# EAGLE schematic lockcontroller_V2 (EAGLE 6.3)
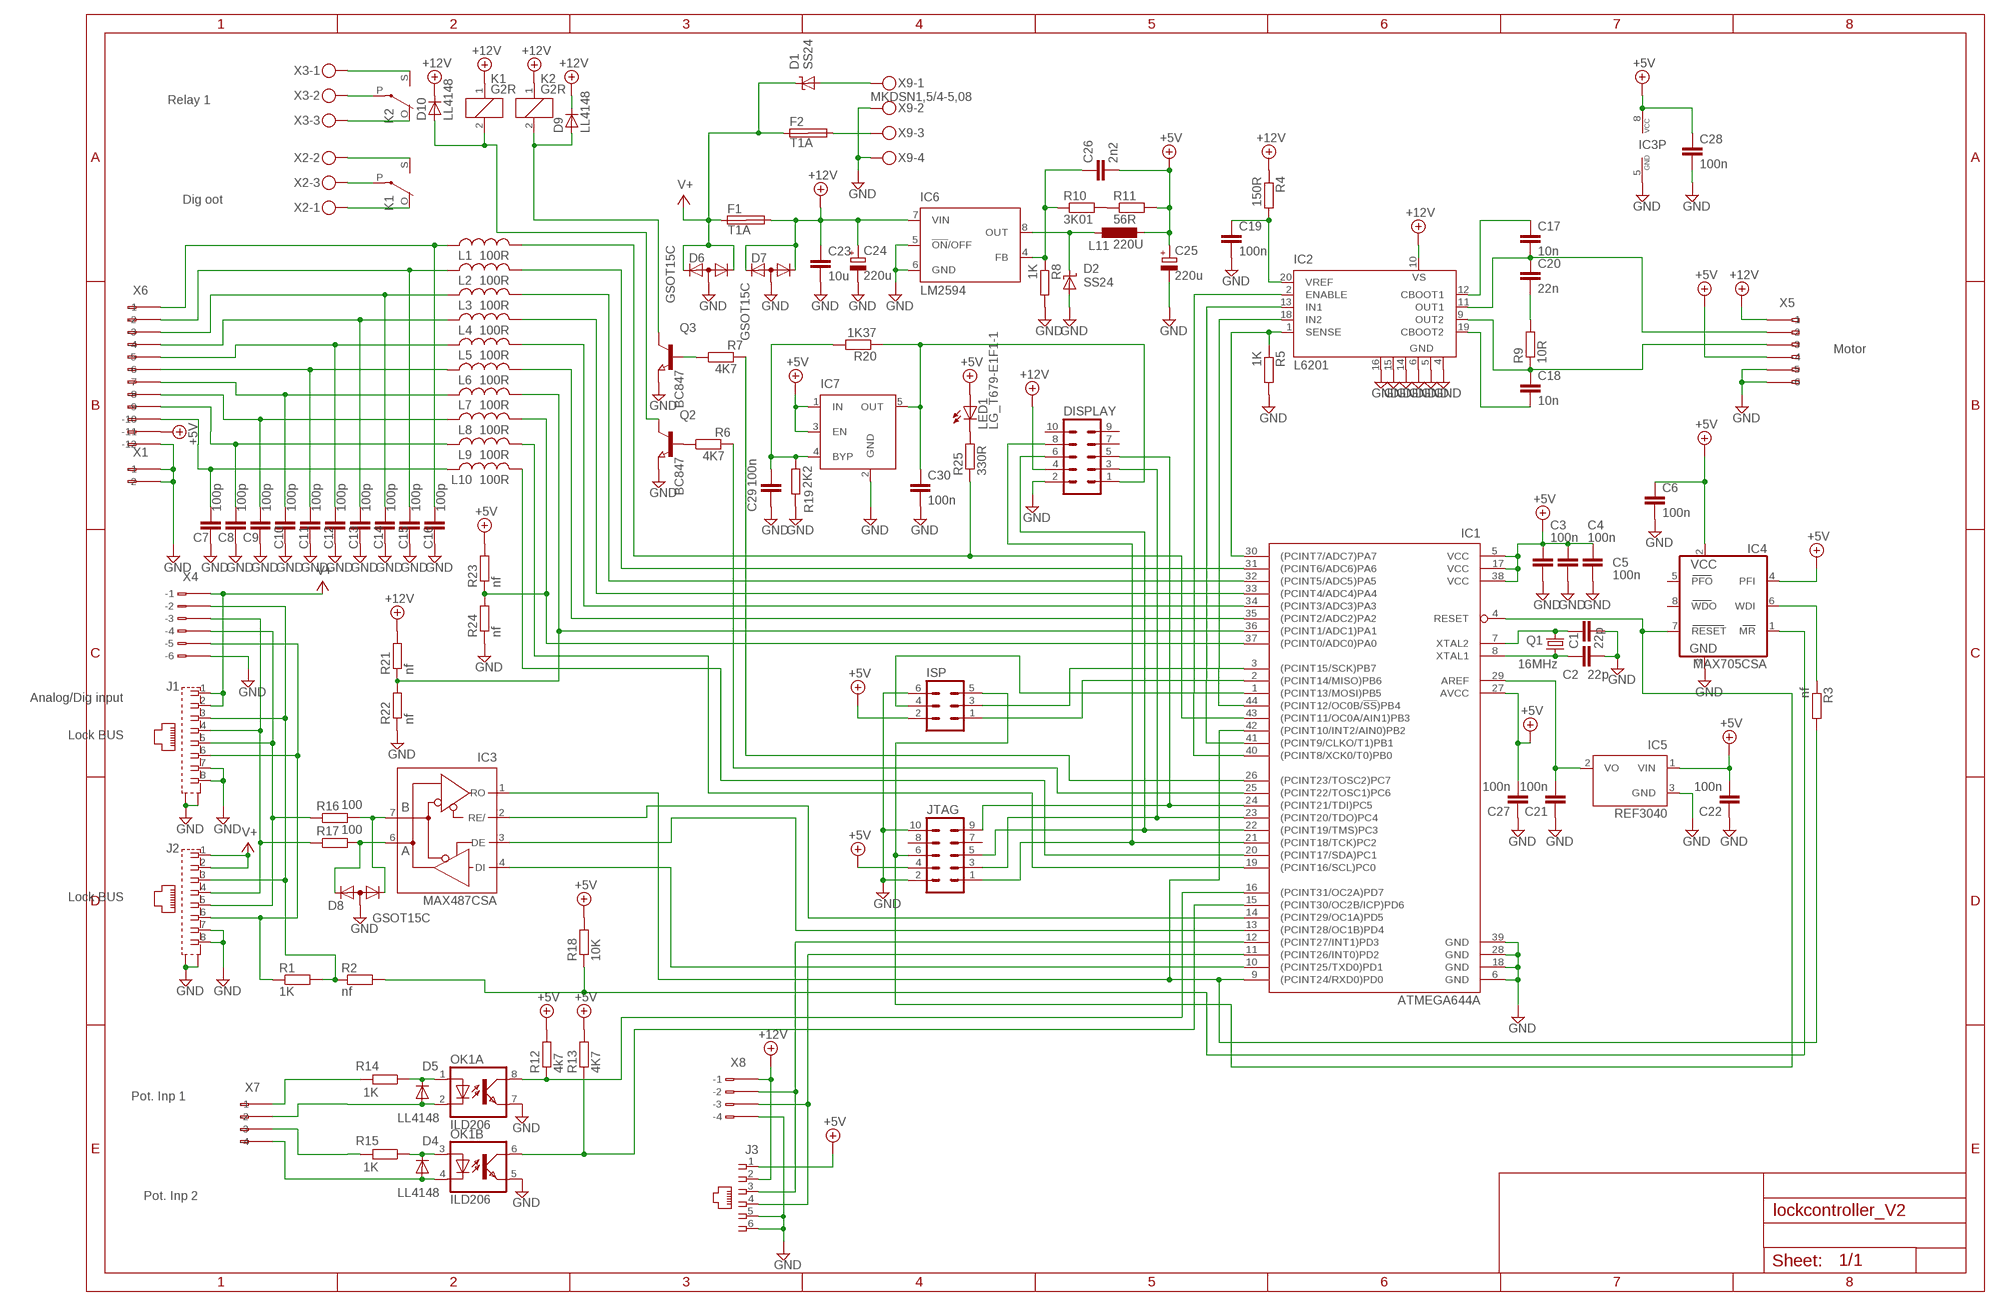
[diagram p0: schematic, sheet 1]

## Parts
C1  22p  C-EUC0603  [C0603]
C2  22p  C-EUC0603  [C0603]
C3  100n  C-EUC0603  [C0603]
C4  100n  C-EUC0603  [C0603]
C5  100n  C-EUC0603  [C0603]
C6  100n  C-EUC0603  [C0603]
C7  100p  C-EUC0603  [C0603]
C8  100p  C-EUC0603  [C0603]
C9  100p  C-EUC0603  [C0603]
C10  100p  C-EUC0603  [C0603]
C11  100p  C-EUC0603  [C0603]
C12  100p  C-EUC0603  [C0603]
C13  100p  C-EUC0603  [C0603]
C14  100p  C-EUC0603  [C0603]
C15  100p  C-EUC0603  [C0603]
C16  100p  C-EUC0603  [C0603]
C17  10n  C-EUC1206  [C1206]
C18  10n  C-EUC1206  [C1206]
C19  100n  C-EUC0603  [C0603]
C20  22n  C-EUC1206  [C1206]
C21  100n  C-EUC0603  [C0603]
C22  100n  C-EUC0603  [C0603]
C23  10u  C-EUC1210  [C1210]
C24  220u  CPOL-EUE5-8.5  [E5-8,5]
C25  220u  CPOL-EUE5-8.5  [E5-8,5]
C26  2n2  C-EUC0603  [C0603]
C27  100n  C-EUC0603  [C0603]
C28  100n  C-EUC0603  [C0603]
C29  100n  C-EUC0603  [C0603]
C30  100n  C-EUC0603  [C0603]
D1  SS24  SUPPRESSOR-SMBG  [SMBG]
D2  SS24  SUPPRESSOR-SMBG  [SMBG]
D4  LL4148  D-MLL-34  [MELF-MLL34]
D5  LL4148  D-MLL-34  [MELF-MLL34]
D6  GSOT15C  DIODE_CA-AC__  [SOT23C]
D7  GSOT15C  DIODE_CA-AC__  [SOT23C]
D8  GSOT15C  DIODE_CA-AC__  [SOT23C]
D9  LL4148  D-MLL-34  [MELF-MLL34]
D10  LL4148  D-MLL-34  [MELF-MLL34]
DISPLAY  MA05-2  [MA05-2]
F1  T1A  SHK20L  [SHK20L]
F2  T1A  SHK20L  [SHK20L]
IC1  ATMEGA644A  [TQFP44]
IC2  L6201  [SO20]
IC3  MAX487CSA  MAX481CSA  [SO08]
IC4  MAX705CSA  [SO08]
IC5  REF3040  MC1525TT  [SOT23]
IC6  LM2594  [SO08]
IC7  MIC5219XX  [SOT23-5]
ISP  MA03-2  [MA03-2]
J1  555141-1  [555153-1]
J2  555141-1  [555153-1]
J3  520250-3  [520250-3]
JTAG  MA05-2  [MA05-2]
K1  G2R  [G2R]
K2  G2R  [G2R]
L1  100R  L-US0603  [R0603]
L2  100R  L-US0603  [R0603]
L3  100R  L-US0603  [R0603]
L4  100R  L-US0603  [R0603]
L5  100R  L-US0603  [R0603]
L6  100R  L-US0603  [R0603]
L7  100R  L-US0603  [R0603]
L8  100R  L-US0603  [R0603]
L9  100R  L-US0603  [R0603]
L10  100R  L-US0603  [R0603]
L11  220U  DO3316P  [DO3316P]
LED1  LG_T679-E1F1-1  [PLCC2]
OK1  ILD206  [SOIC08]
Q1  16MHz  CRYSTALHC49S  [HC49/S]
Q2  BC847  NPN-TRANSISTOR_SOT23  [SOT23]
Q3  BC847  NPN-TRANSISTOR_SOT23  [SOT23]
R1  1K  R-EU_R0603  [R0603]
R2  nf  R-EU_R0603  [R0603]
R3  nf  R-EU_R0603  [R0603]
R4  150R  R-EU_R0603  [R0603]
R5  1K  R-EU_R0603  [R0603]
R6  4K7  R-EU_R0603  [R0603]
R7  4K7  R-EU_R0603  [R0603]
R8  1K  R-EU_R0603  [R0603]
R9  10R  R-EU_R1206  [R1206]
R10  3K01  R-EU_R0603  [R0603]
R11  56R  R-EU_R0603  [R0603]
R12  4k7  R-EU_R0603  [R0603]
R13  4K7  R-EU_R0603  [R0603]
R14  1K  R-EU_R0603  [R0603]
R15  1K  R-EU_R0603  [R0603]
R16  100  R-EU_R0603  [R0603]
R17  100  R-EU_R0603  [R0603]
R18  10K  R-EU_R0603  [R0603]
R19  2K2  R-EU_R0603  [R0603]
R20  1K37  R-EU_R0603  [R0603]
R21  nf  R-EU_R0603  [R0603]
R22  nf  R-EU_R0603  [R0603]
R23  nf  R-EU_R0603  [R0603]
R24  nf  R-EU_R0603  [R0603]
R25  330R  R-EU_R0603  [R0603]
X1  233-502  [233-502]
X2  MKDSN1,5/3-5,08  [MKDSN1,5/3-5,08]
X3  MKDSN1,5/3-5,08  [MKDSN1,5/3-5,08]
X4  233-506  [233-506]
X5  233-506  [233-506]
X6  233-512  [233-512]
X7  233-504  [233-504]
X8  233-504  [233-504]
X9  MKDSN1,5/4-5,08  [MKDSN1,5/4-5,08]

## Nets
+5V: C3.1 C4.1 C5.1 C6.1 C22.2 C25.+ C26.2 C27.2 C28.1 IC1.5(VCC) IC1.17(VCC) IC1.27(AVCC) IC1.38(VCC) IC3.8(VCC) IC4.2(VCC) IC4.4(PFI) IC5.1(VIN) IC7.1(IN) IC7.3(EN) ISP.2 J3.1 JTAG.4 L11.2 LED1.A R11.2 R12.2 R13.2 R18.2 R23.2 X5.A4(-4) X6.A11(-11)
+12V: C23.1 C24.+ D7.1(K1) D7.2(K2) D9.1(C) D10.1(C) DISPLAY.4 F1.2A IC2.10(VS) IC6.7(VIN) J3.2 K1.1 K2.1 R4.1 R21.2 X5.A1(-1) X8.B1(B-1)
GND: C1.2 C2.2 C3.2 C4.2 C5.2 C6.2 C7.2 C8.2 C9.2 C10.2 C11.2 C12.2 C13.2 C14.2 C15.2 C16.2 C19.2 C21.1 C22.1 C23.2 C24.- C25.- C27.1 C28.2 C29.2 C30.2 D2.A D6.3(A) D7.3(A) D8.3(A) DISPLAY.2 IC1.6(GND) IC1.18(GND) IC1.28(GND) IC1.39(GND) IC2.4(GND) IC2.5(GND) IC2.6(GND) IC2.14(GND) IC2.15(GND) IC2.16(GND) IC3.5(GND) IC4.3(GND) IC5.3(GND) IC6.5(!ON!/OFF) IC6.6(GND) IC7.2(GND) ISP.6 J1.7 J1.8 J1.G1(S1) J1.G2(S2) J2.7 J2.8 J2.G1(S1) J2.G2(S2) J3.5 J3.6 JTAG.2 JTAG.10 OK1.5(B:EMIT) OK1.7(A:EMIT) Q2.2(E) Q3.2(E) R5.2 R8.2 R19.1 R22.1 R24.1 X1.A1(-1) X1.A2(-2) X4.B6(B-6) X5.A5(-5) X5.A6(-6) X6.A12(-12) X8.B4(B-4) X9.2 X9.4
N$1: K2.P(2:P) X3.2
N$2: IC1.10((PCINT25/TXD0)PD1) IC3.4(DI)
N$3: IC1.13((PCINT28/OC1B)PD4) IC3.3(DE)
N$4: IC1.14((PCINT29/OC1A)PD5) IC3.2(RE/)
N$5: J1.4 J2.4 R17.1 X4.B3(B-3)
N$6: J1.5 J2.5 R16.1 X4.B4(B-4)
N$7: C2.1 IC1.8(XTAL1) Q1.1
N$8: C1.1 IC1.7(XTAL2) Q1.2
N$9: IC1.4(RESET) IC4.7(RESET) ISP.5 JTAG.6
N$10: C11.1 L6.1 X6.A6(-6)
N$11: C16.1 L1.1 X6.A1(-1)
N$12: IC1.16((PCINT31/OC2A)PD7) OK1.8(A:COL) R12.1
N$13: J1.6 J2.6 R1.1 X4.B5(B-5)
N$14: C15.1 L2.1 X6.A2(-2)
N$15: C14.1 L3.1 X6.A3(-3)
N$16: C13.1 L4.1 X6.A4(-4)
N$17: C12.1 L5.1 X6.A5(-5)
N$18: C10.1 L7.1 X6.A7(-7)
N$19: C9.1 L8.1 X6.A8(-8)
N$20: LED1.C R25.2
N$22: IC1.35((PCINT2/ADC2)PA2) L6.2
N$23: IC1.34((PCINT3/ADC3)PA3) L5.2
N$24: IC1.33((PCINT4/ADC4)PA4) L4.2
N$25: IC1.32((PCINT5/ADC5)PA5) L3.2
N$26: IC1.31((PCINT6/ADC6)PA6) L2.2
N$27: IC1.43((PCINT11/OC0A/AIN1)PB3) L1.2 R25.1
N$28: J1.3 J2.3 R1.2 R2.1 X4.B2(B-2)
N$29: C8.1 L9.1 X6.A9(-9)
N$30: C7.1 L10.1 X6.A10(-10)
N$31: IC1.19((PCINT16/SCL)PC0) L9.2
N$32: IC1.20((PCINT17/SDA)PC1) L10.2
N$33: IC1.44((PCINT12/OC0B/!SS!)PB4) IC2.18(IN2)
N$34: IC1.41((PCINT9/CLKO/T1)PB1) IC2.13(IN1)
N$35: K2.O(2:O) X3.3
N$36: K1.P(2:P) X2.3
N$37: K2.S(2:S) X3.1
N$38: K1.O(2:O) X2.1
N$39: K1.S(2:S) X2.2
N$40: D8.1(K1) IC3.7(B) R16.2
N$41: IC1.40((PCINT8/XCK0/T0)PB0) IC2.2(ENABLE)
N$42: C19.1 IC2.20(VREF) R4.2
N$43: IC1.30((PCINT7/ADC7)PA7) IC2.1(SENSE) R5.1
N$44: C18.1 IC2.9(OUT2) R9.1 X5.A3(-3)
N$45: C18.2 IC2.19(CBOOT2)
N$46: C17.1 IC2.12(CBOOT1)
N$47: C17.2 C20.1 IC2.11(OUT1) X5.A2(-2)
N$48: C20.2 R9.2
N$49: Q2.1(B) R6.1
N$50: Q3.1(B) R7.1
N$51: IC1.25((PCINT22/TOSC1)PC6) R6.2
N$52: IC1.26((PCINT23/TOSC2)PC7) R7.2
N$53: D9.2(A) K2.2 Q3.3(C)
N$54: C21.2 IC1.29(AREF) IC5.2(VO)
N$55: D10.2(A) K1.2 Q2.3(C)
N$56: IC1.11((PCINT26/INT0)PD2) J3.4 X8.B3(B-3)
N$57: IC4.6(WDI) R3.1
N$58: D2.C IC6.8(OUT) L11.1
N$59: IC1.12((PCINT27/INT1)PD3) J3.3 X8.B2(B-2)
N$60: R10.2 R11.1
N$61: C26.1 IC6.4(FB) R8.1 R10.1
N$62: C29.1 IC7.4(BYP) R19.2 R20.2
N$63: IC1.37((PCINT0/ADC0)PA0) L8.2 R23.1 R24.2
N$64: DISPLAY.3 IC1.23((PCINT20/TDO)PC4) JTAG.3
N$65: DISPLAY.6 IC1.22((PCINT19/TMS)PC3) JTAG.5
N$66: IC4.1(MR) R2.2 R18.1
N$67: IC1.15((PCINT30/OC2B/ICP)PD6) OK1.6(B:COL) R13.1
N$68: R14.2 X7.A1(-1)
N$69: D5.2(A) OK1.2(A:C) X7.A2(-2)
N$70: D5.1(C) OK1.1(A:A) R14.1
N$71: D4.1(C) OK1.3(B:A) R15.1
N$72: D4.2(A) OK1.4(B:C) X7.A4(-4)
N$73: R15.2 X7.A3(-3)
N$74: IC1.3((PCINT15/SCK)PB7) ISP.3
N$75: IC1.2((PCINT14/MISO)PB6) ISP.1
N$76: F2.2A X9.3
N$77: IC1.1((PCINT13/MOSI)PB5) ISP.4
N$78: IC1.9((PCINT24/RXD0)PD0) IC1.42((PCINT10/INT2/AIN0)PB2) IC3.1(RO) R3.2
N$79: D1.A X9.1
N$80: D8.2(K2) IC3.6(A) R17.2
N$81: DISPLAY.8 IC1.21((PCINT18/TCK)PC2) JTAG.1
N$82: C30.1 DISPLAY.1 IC7.5(OUT) R20.1
N$83: DISPLAY.5 IC1.24((PCINT21/TDI)PC5) JTAG.9
N$84: IC1.36((PCINT1/ADC1)PA1) L7.2 R21.1 R22.2
V+: D1.C D6.1(K1) D6.2(K2) F1.1A F2.1A J1.1 J1.2 J2.1 J2.2 X4.B1(B-1)
Unconnected: DISPLAY.7 DISPLAY.9 DISPLAY.10 F1.1B F1.2B F2.1B F2.2B IC4.5(PFO) IC4.8(WDO) JTAG.7 JTAG.8 X1.B1(B-1) X1.B2(B-2) X4.A1(-1) X4.A2(-2) X4.A3(-3) X4.A4(-4) X4.A5(-5) X4.A6(-6) X5.B1(B-1) X5.B2(B-2) X5.B3(B-3) X5.B4(B-4) X5.B5(B-5) X5.B6(B-6) X6.B1(B-1) X6.B2(B-2) X6.B3(B-3) X6.B4(B-4) X6.B5(B-5) X6.B6(B-6) X6.B7(B-7) X6.B8(B-8) X6.B9(B-9) X6.B10(B-10) X6.B11(B-11) X6.B12(B-12) X7.B1(B-1) X7.B2(B-2) X7.B3(B-3) X7.B4(B-4) X8.A1(-1) X8.A2(-2) X8.A3(-3) X8.A4(-4)

## Notes on the sheet
- Relay 1
- Dig oot
- Motor
- Analog/Dig input
- Lock BUS
- Lock BUS
- Pot. Inp 1
- Pot. Inp 2

## Library data of the parts
C1-C23 C26-C30 = rcl:C-EU: CAPACITOR, European symbol
C24 C25 = rcl:CPOL-EU: POLARIZED CAPACITOR, European symbol
D1 D2 = diode:SUPPRESSOR-: Suppressor diode
D4 D5 D9 D10 = semicon-smd-ipc:D-: DIODE unfilled
D6-D8 = semicon-smd-ipc:DIODE_CA-AC_: DUAL DIODE
DISPLAY JTAG = con-lstb:MA05-2: PIN HEADER
F1 F2 = fuse:SHK20L: FUSE HOLDER 5 x 20 mm, SH contact, SHH1 Schukat, E1073 Buerklin
IC1 = atmel:ATMEGA644: 8-bit Microcontroller with 64K Bytes In-System Programmable Flash Source: http://www.atmel.com/dyn/resources/prod_documents/doc2593.pdf
IC2 = st-microelectronics:L620: DMOS FULL BRIDGE DRIVER
IC3 = maxim:MAX481CSA: RS485 TRANSEIVER
IC4 = maxim:MAX705CSA: WATCHDOG
IC5 = microchip:MC15*: 2.5V and 4.096V Voltage References Source: http://www.microchip.com .. 21653b.pdf
IC6 = national-semiconductor:LM2594: LM2594 0.5 A Buck Converter
IC7 = v-reg-micrel:MIC5219XX: VOLTAGE REGULATOR; OC_FARNELL: unknown; OC_NEWARK: unknown
ISP = con-lstb:MA03-2: PIN HEADER
J1 J2 = con-amp:555141-1: AMP connector
J3 = con-amp:520250-3: AMP connector
K1 K2 = relay:G2R: RELAY 1 x switch, Omron
L1-L10 = rcl:L-US: INDUCTOR, American symbol
L11 = inductor-coilcraft:DO3316P: COILCRAFT
LED1 = led:*_T679-?-1: LC TOPLED® Low Current LED Source: http://catalog.osram-os.com .. LG_LS_LY_T679_OBS.pdf; COLOR: green
OK1 = optocoupler:ILD2*: Siemens ILD205/206/207/211/213/217 DUAL PHOTOTRANSISTOR SMALL OUTLINE SURFACE MOUNT OPTOCOUPLER Source: 153385-da-01-en-Optocoupler_ILD205-T.pdf
Q1 = crystal:CRYSTAL: CRYSTAL
Q2 Q3 = semicon-smd-ipc:NPN-TRANSISTOR_: NPN TRANSISTOR
R1-R25 = rcl:R-EU_: RESISTOR, European symbol
X1 = con-wago255:233-502: WAGO; MPN: 233-502; OC_FARNELL: 1777096; OC_NEWARK: 58M2630
X2 X3 = con-phoenix-508:MKDSN1,5/3-5,08: MKDSN 1,5/ 3-5,08 Printklemme Nennstrom: 13,5 A Nennspannung: 250 V Rastermaß: 5,08 mm Polzahl: 3 Anschlussart: Schraubanschluss Montage: Löten Anschlussrichtung Leiter/Platine: 0 ° Artikelnummer: 1729131 Source: http://eshop.phoenixcontact.com .. 1729131.pdf; MPN: SMKDSN1,5/3-5,08; OC_FARNELL: 1792904; OC_NEWARK: 70R0299
X4 = con-wago:233-506: WAGO Cage Clamp; MF: Wago Corporation; MPN: 0233-0506; OC_FARNELL: 1777100; OC_NEWARK: 79K2052
X5 = con-wago255:233-506: WAGO; MF: Wago Corporation; MPN: 0233-0506; OC_FARNELL: 1777100; OC_NEWARK: 79K2052
X6 = con-wago255:233-512: WAGO; MF: Wago Corporation; MPN: 0233-0512; OC_FARNELL: 1777102; OC_NEWARK: 79K2055
X7 = con-wago255:233-504: WAGO; MF: Wago Corporation; MPN: 0233-0504; OC_FARNELL: 1777098; OC_NEWARK: 79K2050
X8 = con-wago:233-504: WAGO Cage Clamp; MF: Wago Corporation; MPN: 0233-0504; OC_FARNELL: 1777098; OC_NEWARK: 79K2050
X9 = con-phoenix-508:MKDSN1,5/4-5,08: MKDSN 1,5/ 4-5,08 Printklemme Nennstrom: 13,5 A Nennspannung: 250 V Rastermaß: 5,08 mm Polzahl: 4 Anschlussart: Schraubanschluss Montage: Löten Anschlussrichtung Leiter/Platine: 0 ° Artikelnummer: 1729144 Source: http://eshop.phoenixcontact.com .. 1729144.pdf; MPN: SMKDSN1,5/4-5,08; OC_FARNELL: 1792905; OC_NEWARK: 70R0300